# EAGLE design siggen1 (EAGLE 4.15)
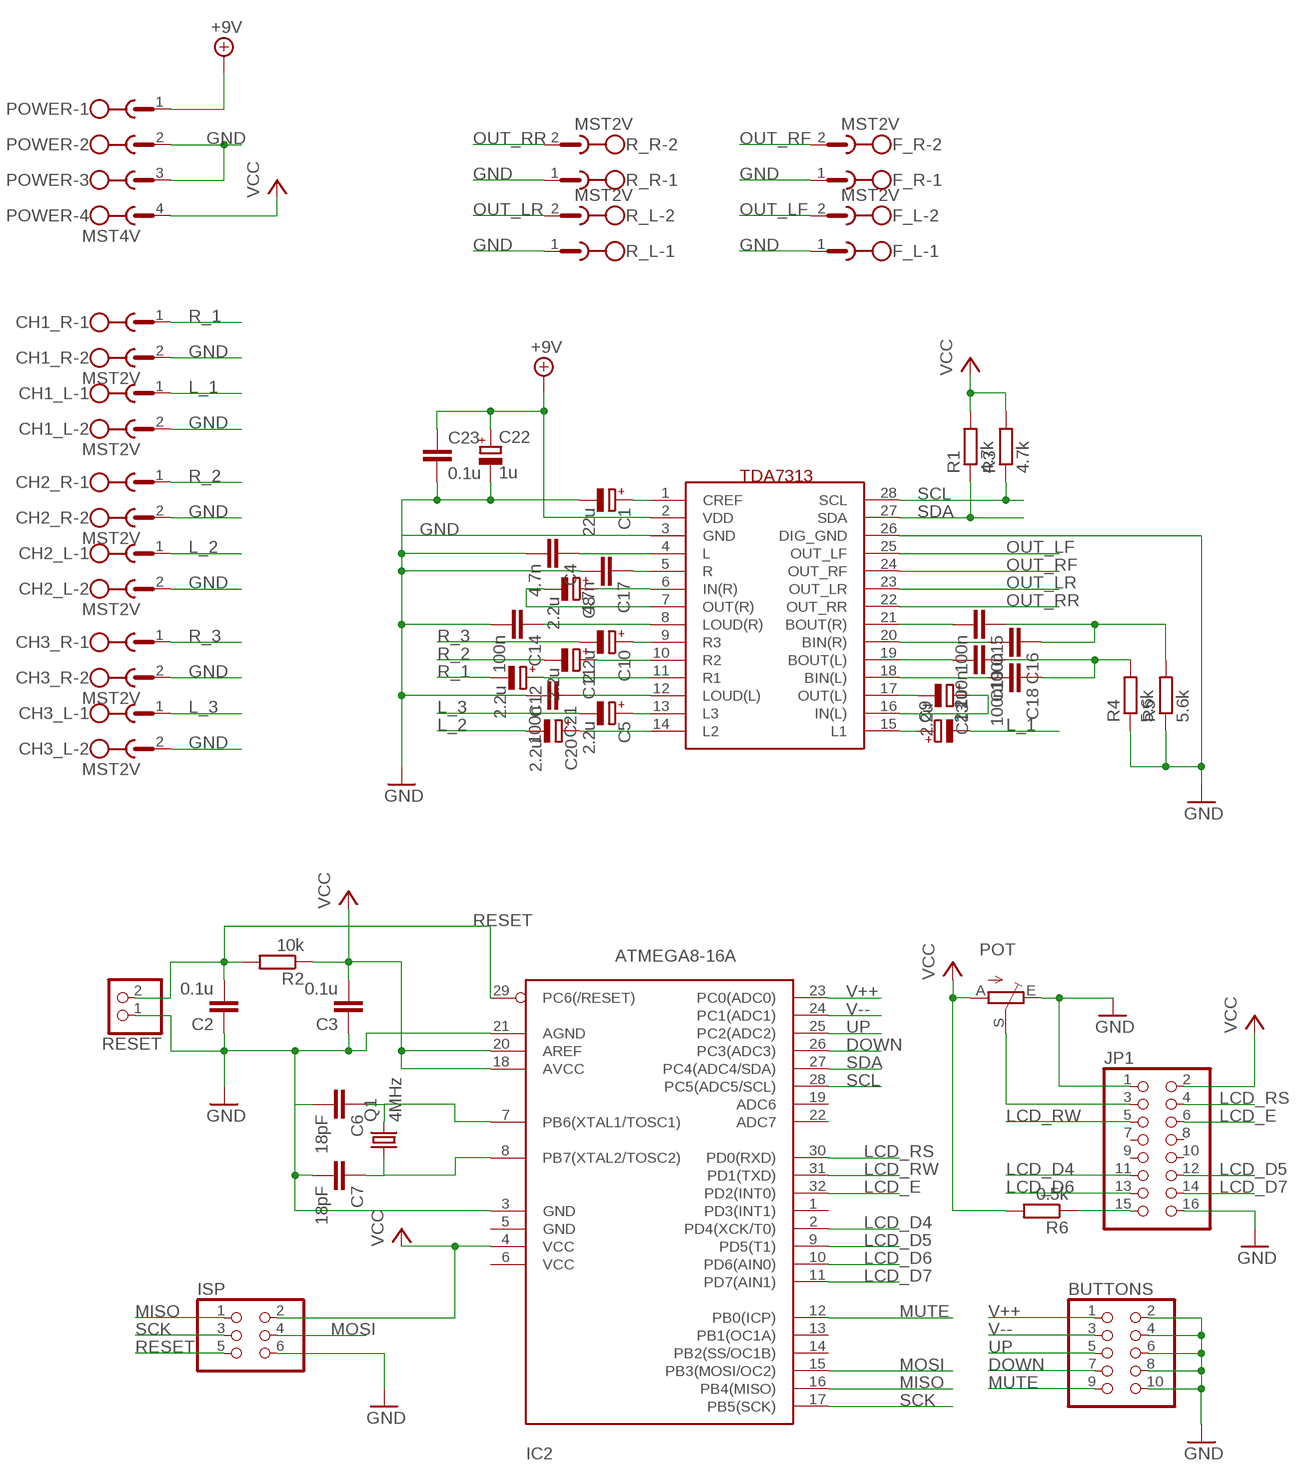
[diagram p0: schematic, sheet 1]

## Parts
BUTTONS  PINHD-2X5  [2X05]
C1  22u  CPOL-EU153CLV-0405  [153CLV-0405]
C2  0.1u  C-EUC0805  [C0805]
C3  0.1u  C-EUC0805  [C0805]
C4  4.7n  C-EUC0805  [C0805]
C5  2.2u  CPOL-EU153CLV-0405  [153CLV-0405]
C6  18pF  C-EUC0805  [C0805]
C7  18pF  C-EUC0805  [C0805]
C8  2.2u  CPOL-EU153CLV-0405  [153CLV-0405]
C9  2.2u  CPOL-EU153CLV-0405  [153CLV-0405]
C10  2.2u  CPOL-EU153CLV-0405  [153CLV-0405]
C11  2.2u  CPOL-EU153CLV-0405  [153CLV-0405]
C12  2.2u  CPOL-EU153CLV-0405  [153CLV-0405]
C13  2.2u  CPOL-EU153CLV-0405  [153CLV-0405]
C14  100n  C-EUC0805  [C0805]
C15  100n  C-EUC0805  [C0805]
C16  100n  C-EUC0805  [C0805]
C17  4.7n  C-EUC0805  [C0805]
C18  100n  C-EUC0805  [C0805]
C19  100n  C-EUC0805  [C0805]
C20  2.2u  CPOL-EU153CLV-0405  [153CLV-0405]
C21  100n  C-EUC0805  [C0805]
C22  1u  CPOL-EU153CLV-0605  [153CLV-0605]
C23  0.1u  C-EUC0805  [C0805]
CH1_L  MST2V  [MSTBV2]
CH1_R  MST2V  [MSTBV2]
CH2_L  MST2V  [MSTBV2]
CH2_R  MST2V  [MSTBV2]
CH3_L  MST2V  [MSTBV2]
CH3_R  MST2V  [MSTBV2]
F_L  MST2V  [MSTBV2]
F_R  MST2V  [MSTBV2]
IC2  ATMEGA8-16A  [TQFP32-08]
ISP  PINHD-2X3  [2X03]
JP1  PINHD-2X8  [2X08]
POT  TRIM_EU-B64Y  [B64Y]
POWER  MST4V  [MSTBV4]
Q1  4MHz  CRYTALHC49S  [HC49/S]
R1  4.7k  R-EU_M0805  [M0805]
R2  10k  R-EU_M0805  [M0805]
R3  4.7k  R-EU_M0805  [M0805]
R4  5.6k  R-EU_R0805  [R0805]
R5  5.6k  R-EU_R0805  [R0805]
R6  0.5k  R-EU_R0805  [R0805]
R_L  MST2V  [MSTBV2]
R_R  MST2V  [MSTBV2]
RESET  PINHD-1X2  [1X02]
U$1  TDA7313_SO28  [SO28]

## Nets
+9V: C22.+ C23.1 POWER.1 U$1.2(VDD)
DOWN: BUTTONS.7 IC2.26(PC3(ADC3))
GND: BUTTONS.2 BUTTONS.4 BUTTONS.6 BUTTONS.8 BUTTONS.10 C1.- C2.1 C3.1 C4.2 C6.2 C7.2 C14.2 C17.2 C21.2 C22.- C23.2 CH1_L.2 CH1_R.2 CH2_L.2 CH2_R.2 CH3_L.2 CH3_R.2 F_L.1 F_R.1 IC2.3(GND) IC2.21(AGND) ISP.6 JP1.1 JP1.16 POT.E POWER.2 POWER.3 R4.1 R5.1 R_L.1 R_R.1 RESET.1 U$1.3(GND) U$1.26(DIG_GND)
L_1: C9.- CH1_L.1
L_2: C20.- CH2_L.1
L_3: C5.- CH3_L.1
LCD_D4: IC2.2(PD4(XCK/T0)) JP1.11
LCD_D5: IC2.9(PD5(T1)) JP1.12
LCD_D6: IC2.10(PD6(AIN0)) JP1.13
LCD_D7: IC2.11(PD7(AIN1)) JP1.14
LCD_E: IC2.32(PD2(INT0)) JP1.6
LCD_RS: IC2.30(PD0(RXD)) JP1.4
LCD_RW: IC2.31(PD1(TXD)) JP1.5
MISO: IC2.16(PB4(MISO)) ISP.1
MOSI: IC2.15(PB3(MOSI/OC2)) ISP.4
MUTE: BUTTONS.9 IC2.12(PB0(ICP))
N$1: JP1.15 R6.1
N$2: JP1.3 POT.S
N$3: C6.1 IC2.7(PB6(XTAL1/TOSC1)) Q1.2
N$4: C7.1 IC2.8(PB7(XTAL2/TOSC2)) Q1.1
N$7: C20.+ U$1.14(L2)
N$9: C5.+ U$1.13(L3)
N$13: C21.1 U$1.12(LOUD(L))
N$14: C12.+ U$1.11(R1)
N$15: C11.+ U$1.10(R2)
N$16: C10.+ U$1.9(R3)
N$17: C17.1 U$1.5(R)
N$18: C4.1 U$1.4(L)
N$19: C1.+ U$1.1(CREF)
N$20: C8.+ U$1.6(IN(R))
N$21: C8.- U$1.7(OUT(R))
N$22: C14.1 U$1.8(LOUD(R))
N$23: C9.+ U$1.15(L1)
N$24: C13.+ U$1.16(IN(L))
N$25: C13.- U$1.17(OUT(L))
N$26: C18.2 U$1.18(BIN(L))
N$27: C18.1 C19.1 R4.2
N$28: C19.2 U$1.19(BOUT(L))
N$29: C16.2 U$1.20(BIN(R))
N$30: C15.1 C16.1 R5.2
N$31: C15.2 U$1.21(BOUT(R))
OUT_LF: F_L.2 U$1.25(OUT_LF)
OUT_LR: R_L.2 U$1.23(OUT_LR)
OUT_RF: F_R.2 U$1.24(OUT_RF)
OUT_RR: R_R.2 U$1.22(OUT_RR)
R_1: C12.- CH1_R.1
R_2: C11.- CH2_R.1
R_3: C10.- CH3_R.1
RESET: C2.2 IC2.29(PC6(/RESET)) ISP.5 R2.2 RESET.2
SCK: IC2.17(PB5(SCK)) ISP.3
SCL: IC2.28(PC5(ADC5/SCL)) R3.1 U$1.28(SCL)
SDA: IC2.27(PC4(ADC4/SDA)) R1.1 U$1.27(SDA)
UP: BUTTONS.5 IC2.25(PC2(ADC2))
V++: BUTTONS.1 IC2.23(PC0(ADC0))
V--: BUTTONS.3 IC2.24(PC1(ADC1))
VCC: C3.2 IC2.4(VCC) IC2.18(AVCC) IC2.20(AREF) ISP.2 JP1.2 POT.A POWER.4 R1.2 R2.1 R3.2 R6.2
Unconnected: IC2.1(PD3(INT1)) IC2.5(GND) IC2.6(VCC) IC2.13(PB1(OC1A)) IC2.14(PB2(SS/OC1B)) IC2.19(ADC6) IC2.22(ADC7) JP1.7 JP1.8 JP1.9 JP1.10

## Library data of the parts
BUTTONS = pinhead:PINHD-2X5: PIN HEADER
C1 C5 C8-C13 C20 C22 = rcl:CPOL-EU: POLARIZED CAPACITOR, European symbol
C2-C4 C6 C7 C14-C19 C21 C23 = rcl:C-EU: CAPACITOR, European symbol
CH1_L CH1_R CH2_L CH2_R CH3_L CH3_R F_L F_R R_L R_R = con-phoenix-508:MST2V: PHOENIX
IC2 = avr:ATMEGA8: MICROCONTROLLER 8 Kbytes FLASH 1 kbytes SRAM 512 bytes EEPROM USART 6-channel 10 bit ADC 2-channel 8 bit ADC
ISP = pinhead:PINHD-2X3: PIN HEADER
JP1 = pinhead:PINHD-2X8: PIN HEADER
POT = pot:TRIM_EU-: POTENTIOMETER
POWER = con-phoenix-508:MST4V: PHOENIX
Q1 = crystal:CRYTAL: CRYSTAL
R1-R6 = rcl:R-EU_: RESISTOR, European symbol
RESET = pinhead:PINHD-1X2: PIN HEADER
U$1 = TDA7313:TDA7313_SO28

## Board
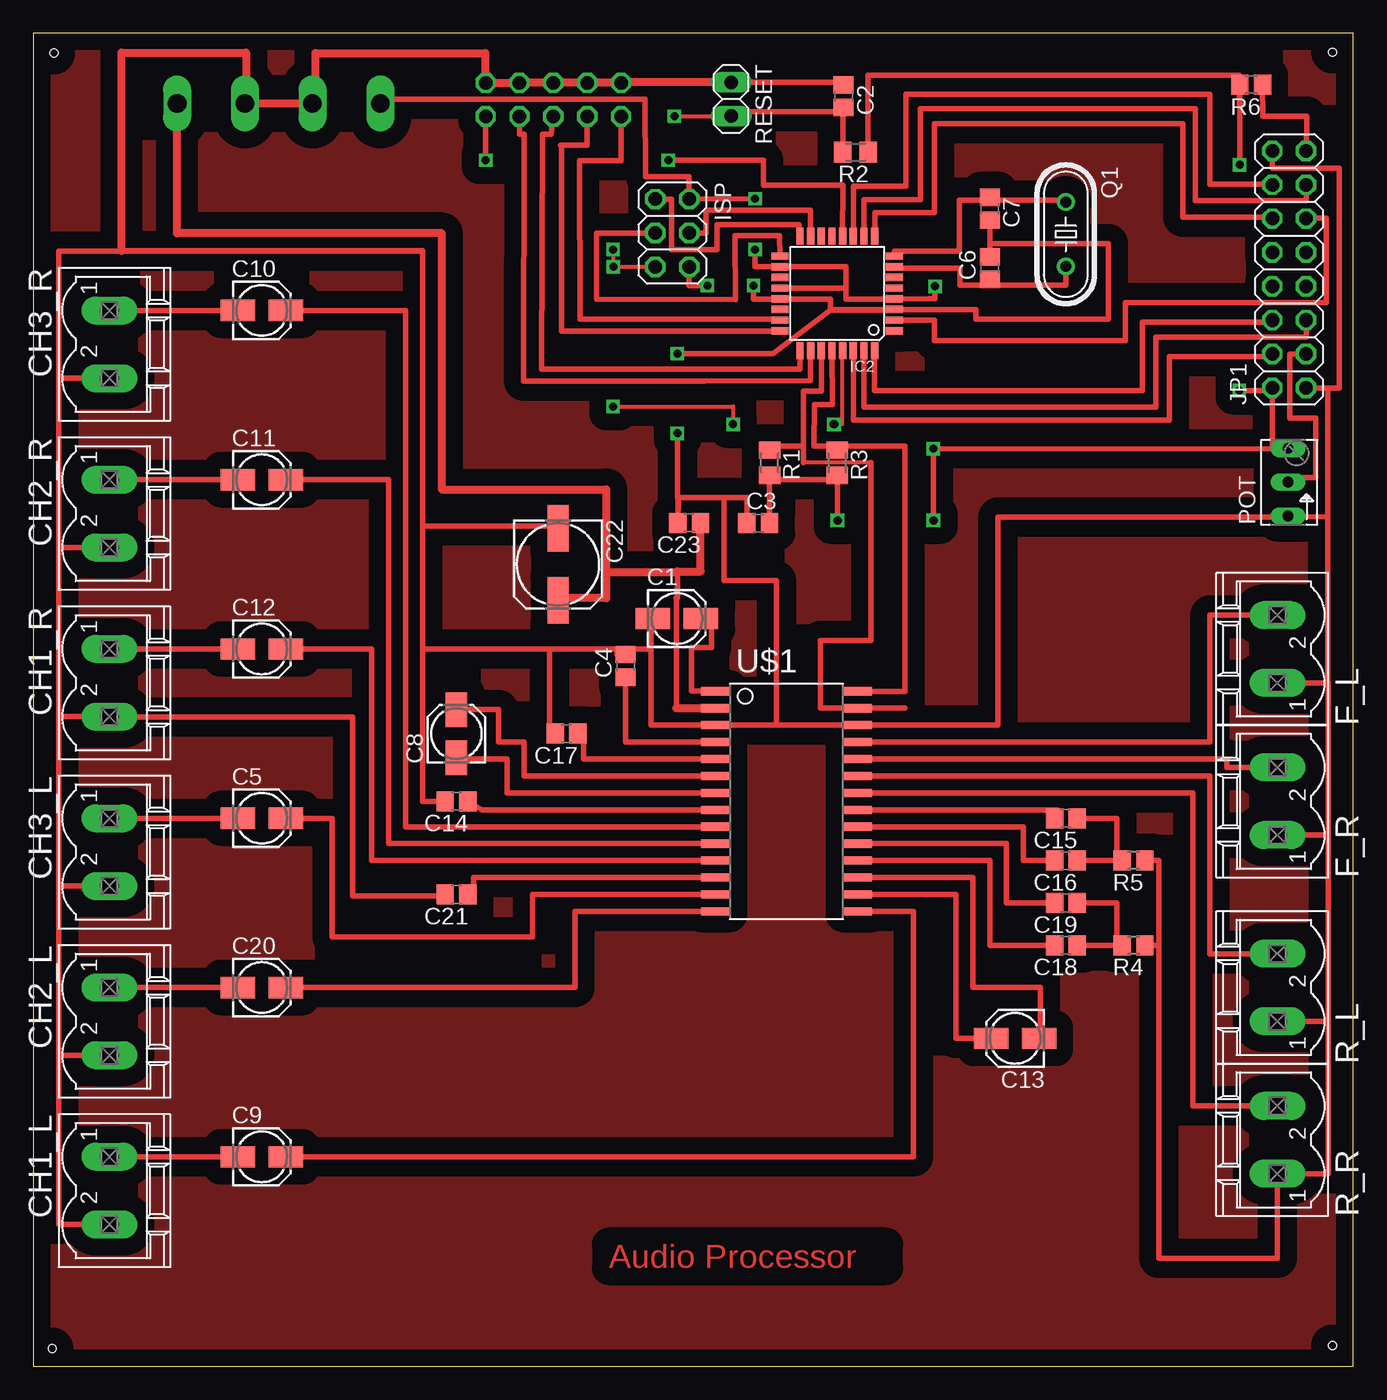
[diagram p1: board, top side]
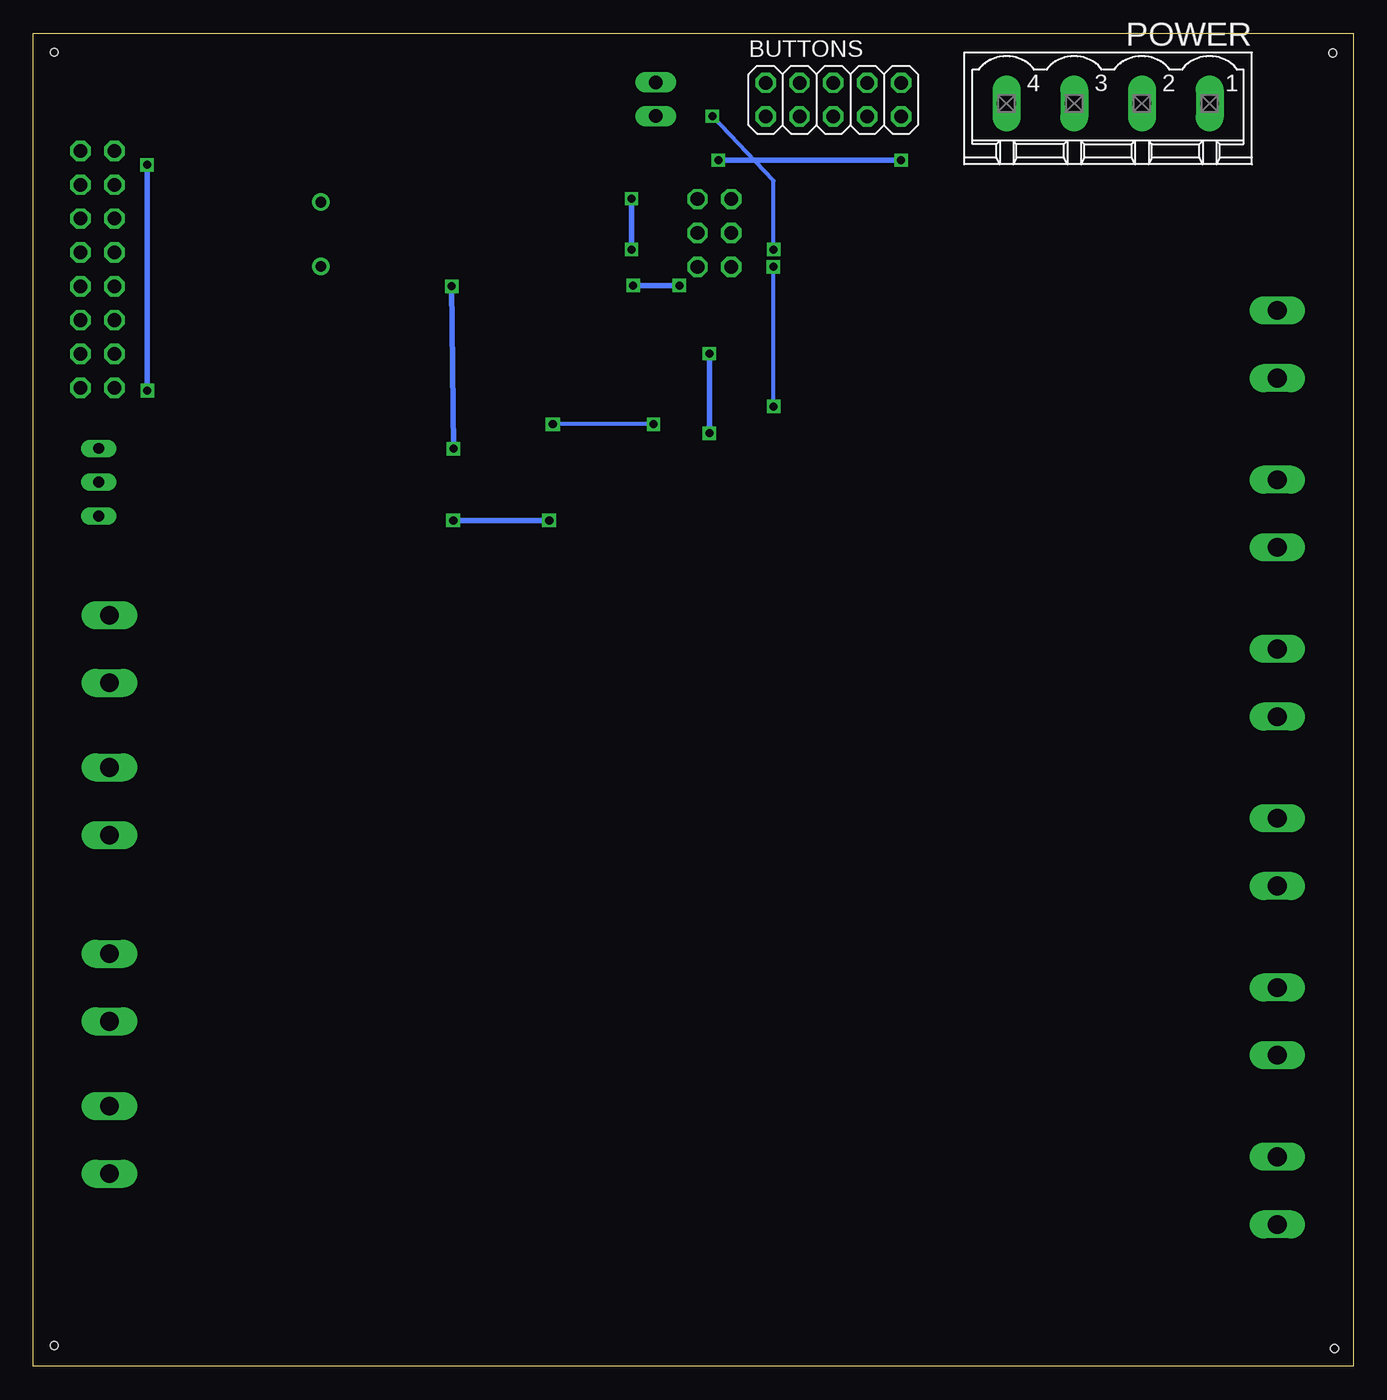
[diagram p2: board, bottom side, seen from below]

Size 99.04 x 100 mm. Coordinates in mm from the lower left corner, seen from the top.
Outline: 0,0 99.04,0 99.04,100 0,100 0,0
Copper layers (1*16): Top 0.035mm / dielectric 1.5mm / Bottom 0.035mm
Design rules "default": minimum track width 10mil, minimum drill 24mil, track to track 8mil, track to pad 8mil, pad to pad 8mil, via to via 8mil, smd to smd 8mil, copper to edge 40mil, drill to drill 8mil, minimum pad ring 10mil, minimum via ring 8mil, stop-mask expansion 4mil, vias tented up to drill 0mil, thermal gap 10mil
Holes 0.6 mm at 97.47,98.58 1.55,98.51 1.42,1.33 97.47,1.55

### Footprints (pad centres in the part's own frame; a part is rotated, then mirrored left to right if it is on the bottom)
2X05 = drill 1.016 octagon: 1 -5.08,-1.27; 2 -5.08,1.27; 3 -2.54,-1.27; 4 -2.54,1.27; 5 0,-1.27; 6 0,1.27; 7 2.54,-1.27; 8 2.54,1.27; 9 5.08,-1.27; 10 5.08,1.27
153CLV-0405 = smd 2.6 x 1.6: + 1.8,0; - -1.8,0
C0805 = smd 1.3 x 1.5: 1 -0.85,0; 2 0.85,0
153CLV-0605 = smd 3.5 x 1.6: + 2.7,0; - -2.7,0
MSTBV2 = drill 1.397 long: 1 -2.54,0; 2 2.54,0
TQFP32-08 = smd 1.27 x 0.559: 1 -4.293,2.8; 2 -4.293,2; 3 -4.293,1.2; 4 -4.293,0.4; 5 -4.293,-0.4; 6 -4.293,-1.2; 7 -4.293,-2; 8 -4.293,-2.8; 17 4.293,-2.8; 18 4.293,-2; 19 4.293,-1.2; 20 4.293,-0.4; 21 4.293,0.4; 22 4.293,1.2; 23 4.293,2; 24 4.293,2.8 | smd 0.559 x 1.27: 9 -2.8,-4.293; 10 -2,-4.293; 11 -1.2,-4.293; 12 -0.4,-4.293; 13 0.4,-4.293; 14 1.2,-4.293; 15 2,-4.293; 16 2.8,-4.293; 25 2.8,4.293; 26 2,4.293; 27 1.2,4.293; 28 0.4,4.293; 29 -0.4,4.293; 30 -1.2,4.293; 31 -2,4.293; 32 -2.8,4.293
2X03 = drill 1.016 octagon: 1 -2.54,-1.27; 2 -2.54,1.27; 3 0,-1.27; 4 0,1.27; 5 2.54,-1.27; 6 2.54,1.27
2X08 = drill 1.016 octagon: 1 -8.89,-1.27; 2 -8.89,1.27; 3 -6.35,-1.27; 4 -6.35,1.27; 5 -3.81,-1.27; 6 -3.81,1.27; 7 -1.27,-1.27; 8 -1.27,1.27; 9 1.27,-1.27; 10 1.27,1.27; 11 3.81,-1.27; 12 3.81,1.27; 13 6.35,-1.27; 14 6.35,1.27; 15 8.89,-1.27; 16 8.89,1.27
B64Y = drill 0.813 long: A 2.54,0; E -2.54,0; S 0,0
MSTBV4 = drill 1.397 long: 1 -7.62,0; 2 -2.54,0; 3 2.54,0; 4 7.62,0
HC49/S = drill 0.813 round: 1 -2.413,0; 2 2.413,0
M0805 = smd 1.3 x 1.6: 1 -0.95,0; 2 0.95,0
R0805 = smd 1.3 x 1.5: 1 -0.85,0; 2 0.85,0
1X02 = drill 1.016 long: 1 -1.27,0; 2 1.27,0
SO28 = smd 0.61 x 2.21: 1 -8.255,-5.315; 2 -6.985,-5.315; 3 -5.715,-5.315; 4 -4.445,-5.315; 5 -3.175,-5.315; 6 -1.905,-5.315; 7 -0.635,-5.315; 8 0.635,-5.315; 9 1.905,-5.315; 10 3.175,-5.315; 11 4.445,-5.315; 12 5.715,-5.315; 13 6.985,-5.315; 14 8.255,-5.315; 15 8.255,5.315; 16 6.985,5.315; 17 5.715,5.315; 18 4.445,5.315; 19 3.175,5.315; 20 1.905,5.315; 21 0.635,5.315; 22 -0.635,5.315; 23 -1.905,5.315; 24 -3.175,5.315; 25 -4.445,5.315; 26 -5.715,5.315; 27 -6.985,5.315; 28 -8.255,5.315

### Placement (x,y rotation side)
BUTTONS  39.02,95.02 0 bottom
C1  48.29,56.1 0 top
C2  60.8,95.28 270 top
C3  54.38,63.24 0 top
C4  44.45,52.54 90 top
C5  17.14,41.11 0 top
C6  71.75,82.39 90 top
C7  71.75,86.83 270 top
C8  31.74,47.46 90 top
C9  17.14,15.71 0 top
C10  17.14,79.21 0 top
C11  17.14,66.51 0 top
C12  17.14,53.81 0 top
C13  73.66,24.6 180 top
C14  31.74,42.38 180 top
C15  77.46,41.11 180 top
C16  77.46,37.94 180 top
C17  40,47.46 180 top
C18  77.46,31.58 180 top
C19  77.46,34.76 180 top
C20  17.14,28.41 0 top
C21  31.74,35.39 180 top
C22  39.37,60.16 270 top
C23  49.21,63.27 180 top
CH1_L  5.71,13.17 270 top
CH1_R  5.71,51.27 270 top
CH2_L  5.71,25.87 270 top
CH2_R  5.71,63.97 270 top
CH3_L  5.71,38.57 270 top
CH3_R  5.71,76.67 270 top
F_L  93.34,53.81 90 top
F_R  93.34,42.38 90 top
IC2  60.32,80.48 180 top
ISP  47.94,85.02 270 top
JP1  94.23,82.29 90 top
POT  94.13,66.32 90 top
POWER  18.41,94.74 180 bottom
Q1  77.46,84.92 270 top
R1  55.24,67.78 270 top
R2  61.69,91.08 180 top
R3  60.32,67.78 270 top
R4  82.55,31.58 180 top
R5  82.55,37.94 180 top
R6  91.37,96.13 180 top
R_L  93.34,28.41 90 top
R_R  93.34,16.98 90 top
RESET  52.35,95.05 270 top
U$1  56.51,42.38 270 top

### Tracks (layer width: path | path; a pad name or v marks a point on that pad's centre or on a via)
+9V
  Top 0.406: 48.26,57.62 48.26,49.37 | 48.26,57.62 48.22,57.62 | 39.37,57.62 C22.+ | 48.32,59.62 48.32,59.59 48.32,57.62 48.26,57.62 | 42.98,59.75 42.98,59.59
  Top 0.61: 48.26,49.37 U$1.2 | C23.1 50.06,59.62 48.32,59.62 | POWER.1 10.79,84.99 30.66,84.99 30.66,65.78 42.98,65.78 42.98,59.75 42.98,57.62 39.37,57.62 | 42.98,59.59 48.32,59.59
DOWN
  Top 0.406: 58.32,76.03 58.38,76.03 | 58.32,76.03 IC2.26 | 58.32,76.03 58.32,73.94 50.35,73.91 36.79,73.91 36.83,92.42 36.48,92.42 BUTTONS.7 | 58.32,76.03
GND  (via drill 0.6)
  Top 0.406: 97.15,51.27 F_L.1 | 97.15,51.27 97.15,39.84 | 97.15,39.84 F_R.1 | 97.15,39.84 97.15,25.87 | 97.15,25.87 R_L.1 | 97.15,25.87 97.15,14.44 R_R.1 93.34,8.09 84.45,8.09 84.45,37.94 | 1.9,74.13 CH3_R.2 | 1.9,61.43 1.9,74.13 | 1.9,61.43 CH2_R.2 | 1.9,48.73 1.9,61.43 | 1.9,48.73 CH1_R.2 5.71,48.7 | 1.9,36.03 1.9,48.73 | 1.9,36.03 CH3_L.2 | 1.9,23.33 1.9,36.03 | 1.9,23.33 CH2_L.2 | 1.9,23.33 1.9,10.63 CH1_L.2 | 84.45,37.94 R5.1 | 84.45,37.94 84.45,31.58 R4.1 | 46.35,53.81 46.35,48.09 U$1.3 55.75,48.09 | 46.35,53.81 44.45,53.81 C4.2 43.81,53.39 43.81,53.81 38.73,53.81 | 39.37,47.46 C17.2 38.73,47.46 38.73,53.81 | 39.37,63.02 39.37,63.34 | 29.2,53.81 38.73,53.81 | C14.2 29.2,42.38 29.2,53.81 | 55.75,48.09 U$1.26 72.38,48.09 72.38,63.72 94.29,63.72 | 29.2,83.66 29.2,63.34 | 29.2,63.34 29.2,53.81 | 29.2,83.66 1.9,83.66 1.9,74.13 | C7.2 C6.2 71.75,84.23 80.64,84.23 80.64,78.58 70.7,78.58 70.7,79.27 70.61,79.27 | 56.03,80.07 IC2.21 | 56.03,80.07 59.81,80.07 59.81,79.3 59.84,79.3 59.84,79.27 | 59.84,79.27 59.84,79.24 64.61,79.24 IC2.3 | IC2.3 | 70.61,79.27 IC2.3 | 97.12,73.4 JP1.1 | 97.12,63.75 97.12,73.4 | 94.29,63.72 97.12,63.75 | 94.29,63.72 94.13,63.72 POT.E | 97.15,51.27 97.15,51.24 97.12,51.24 97.12,63.75 | 21.14,94.77 20.95,94.77 POWER.3 | 15.87,94.77 POWER.2 15.87,94.83 | 15.87,94.83 21.17,94.83 | 33.9,96.39 33.94,96.39 BUTTONS.10 | 36.54,96.29 BUTTONS.8 36.48,96.32 | 39.21,96.32 39.02,96.32 BUTTONS.6 | 41.62,96.32 41.56,96.32 BUTTONS.4 | BUTTONS.2 44.1,96.32 44.29,96.32 44.29,96.36 | 29.2,83.66 29.2,83.69 6.63,83.69 | 15.97,94.83 15.87,94.83 | C1.- 46.49,56.03 46.35,56.03 46.35,53.81 | C3.1 53.53,65.18 51.81,65.18 | 48.41,65.18 48.35,65.18 48.35,63.34
  Top 0.406: 48.35,63.34 48.36,63.34 C23.2 48.41,65.24 48.41,65.18 | 48.35,63.34 48.32,63.34 | 39.37,63.02 C22.- | 29.2,63.34 29.2,63.02 39.37,63.02 | C21.2 30.89,35.3 23.97,35.3 23.97,48.7 5.71,48.7 | 5.71,48.7 5.65,48.7 | 52.35,96.36 RESET.1 | C2.1 60.8,96.32 RESET.1 | RESET.1 | 56.03,80.07 54.03,80.07 v54.03,81.08 | ISP.6 49.21,81.08 v50.57,81.08 50.54,81.05 | JP1.16 92.96,89.88 97.98,89.88 97.98,73.4 97.12,73.4 | 59.84,79.27 70.61,79.27 | 59.84,79.27 55.49,75.97 v48.32,75.97 | 48.41,65.18 48.32,65.18 v48.32,70 | 51.81,65.18 48.41,65.18 | 51.81,65.18 51.81,58.95 55.75,58.95 55.75,48.09
  Top 0.61: 15.87,94.77 20.95,94.77 | 21.17,94.83 21.17,98.51 33.9,98.51 33.9,96.39 | BUTTONS.10 BUTTONS.8 | 36.48,96.32 39.02,96.32 41.56,96.32 44.1,96.32 | 6.63,83.69 6.63,98.55 15.97,98.55 15.97,94.83 | 44.29,96.36 52.35,96.36
  Bottom 0.406: 54.07,81.08 v54.03,81.08 v50.57,81.08 | v48.32,70 v48.32,75.97
L_1
  Top 0.406: CH1_L.1 C9.-
L_2
  Top 0.406: CH2_L.1 C20.-
L_3
  Top 0.406: CH3_L.1 C5.-
LCD_D4
  Top 0.406: JP1.11 95.5,86.13 96.99,86.13 96.99,79.78 81.94,79.78 81.94,76.96 67.62,76.96 67.62,78.48 IC2.2 | IC2.2
LCD_D5
  Top 0.406: JP1.12 92.96,86.19 86.23,86.19 86.23,93.21 67.62,93.21 67.62,86.54 63.15,86.54 63.15,85.05 63.12,85.05 IC2.9
LCD_D6
  Top 0.406: JP1.13 95.5,87.43 87.18,87.43 87.18,94.36 66.57,94.36 66.57,87.53 62.32,87.53 62.32,85.08 | 62.32,85.08 | IC2.10 62.32,85.08
LCD_D7
  Top 0.406: JP1.14 92.96,88.67 88.26,88.67 88.26,95.43 65.46,95.43 65.46,88.55 61.53,88.55 61.53,85.08 61.52,85.08 | 61.52,85.08 61.5,85.08 | IC2.11 61.52,85.08
LCD_E
  Top 0.406: JP1.6 92.96,78.32 83.21,78.32 83.21,73.21 63.11,73.21 63.11,76.07 | 63.11,76.07 63.12,76.07 IC2.32 | 63.11,76.07 63.05,76.07
LCD_RS
  Top 0.406: JP1.4 92.96,75.75 85.24,75.75 85.24,70.99 61.53,70.99 61.53,76 61.52,76 | 61.52,76 61.46,76 | 61.52,76 IC2.30
LCD_RW
  Top 0.406: JP1.5 95.5,77.21 84.23,77.21 84.23,71.97 62.32,71.97 62.32,76.1 | 62.32,76.1 62.29,76.1 | 62.32,76.1 IC2.31 | 62.32,76.1
MISO
  Top 0.406: IC2.16 57.52,84.89 57.43,84.89 57.43,85.66 51.3,85.66 51.3,83.78 47.87,83.78 47.87,87.56 ISP.1
MOSI
  Top 0.406: IC2.15 58.32,86.26 58.29,86.26 58.29,86.73 50.48,86.73 50.48,85.02 ISP.4
MUTE  (via drill 0.6)
  Top 0.406: v33.94,90.48 BUTTONS.9 | IC2.12 60.73,88.61 54.76,88.61 54.76,90.48 v47.65,90.48
  Bottom 0.406: v33.94,90.48 v47.65,90.48
N$1
  Top 0.406: JP1.15 95.53,93.78 92.26,93.78 R6.1
N$2
  Top 0.406: POT.S 94.13,66.67 96.23,66.67 96.23,71.11 94.26,71.11 94.26,75.94 JP1.3 95.53,75.94
N$3
  Top 0.406: IC2.7 64.61,82.39 69.53,82.39 69.53,81.11 71.75,81.11 | 71.75,81.11 C6.1 | Q1.2 77.46,81.11 71.75,81.11
N$4
  Top 0.406: IC2.8 64.61,83.66 69.5,83.66 69.5,87.47 71.75,87.47 | Q1.1 77.46,87.47 71.75,87.47 | 71.75,87.47 C7.1
N$5  (via drill 0.6)
  other vias: 90.48,73.18
N$6  (via drill 0.6)
  other vias: 60.35,63.46
N$7
  Top 0.406: C20.+ 40.64,28.41 40.64,34.12 U$1.14
N$8  (via drill 0.6)
  other vias: 67.56,63.46
N$9
  Top 0.406: C5.+ 22.41,41.11 22.41,32.22 37.46,32.22 37.46,35.39 U$1.13
N$10
  pour Top (isolate 1.27, no thermals): 0.63,99.59 97.02,99.59 arc-90 98.29,98.32 98.29,0.88 2.12,0.88 arc-90 0.85,2.15 0.85,99.4
N$12  (via drill 0.6)
  other vias: 60.03,70.67
N$13
  Top 0.406: U$1.12 33.02,36.66 33.02,35.39 C21.1
N$14
  Top 0.406: C12.+ 25.39,53.81 25.39,37.94 U$1.11
N$15
  Top 0.406: C11.+ 26.66,66.51 26.66,39.2 U$1.10
N$16
  Top 0.406: C10.+ 27.93,79.21 27.93,40.48 U$1.9
N$17
  Top 0.406: U$1.5 41.27,45.55 41.27,47.46 C17.1
N$18
  Top 0.406: U$1.4 44.45,46.82 44.45,51.27 C4.1
N$19
  Top 0.406: U$1.1 51.2,50.67 49.37,50.67 49.37,53.91 50.89,53.91 50.89,56.06 50.09,56.06 C1.+
N$20
  Top 0.406: C8.+ 34.92,49.26 34.92,46.82 36.83,46.82 36.83,44.28 U$1.6
N$21
  Top 0.406: U$1.7 35.55,43.02 35.55,45.55 31.74,45.55 C8.-
N$22
  Top 0.406: U$1.8 33.65,41.74 C14.1
N$23
  Top 0.406: C9.+ 66.03,15.71 66.03,34.12 U$1.15
N$24
  Top 0.406: U$1.16 69.21,35.39 69.21,24.6 C13.+
N$25
  Top 0.406: U$1.17 70.48,36.66 70.48,28.41 75.56,28.41 75.56,24.6 C13.-
N$26
  Top 0.406: U$1.18 71.75,37.94 71.75,31.58 C18.2
N$27
  Top 0.406: C18.1 81.27,31.58 | 81.27,31.58 R4.2 | C19.1 81.27,34.76 81.27,31.58
N$28
  Top 0.406: U$1.19 73.02,39.2 73.02,34.76 C19.2
N$29
  Top 0.406: U$1.20 74.29,40.48 74.29,37.94 C16.2 76.83,37.94
N$30
  Top 0.406: 81.91,37.94 R5.2 81.27,37.94 | C16.1 81.27,37.94 | C15.1 81.27,41.11 81.27,37.94
N$31
  Top 0.406: C15.2 76.83,41.11 76.83,41.74 U$1.21
OUT_LF
  Top 0.406: U$1.25 88.26,46.82 88.26,56.35 F_L.2
OUT_LR
  Top 0.406: U$1.23 88.26,44.28 88.26,30.95 R_L.2
OUT_RF
  Top 0.406: U$1.24 89.53,45.55 89.53,44.92 F_R.2
OUT_RR
  Top 0.406: U$1.22 86.99,43.02 86.99,19.52 R_R.2
R_1
  Top 0.406: CH1_R.1 C12.-
R_2
  Top 0.406: CH2_R.1 C11.-
R_3
  Top 0.406: CH3_R.1 C10.-
RESET  (via drill 0.6)
  Top 0.305: v43.52,82.48 ISP.5 | v43.52,82.48 43.49,82.48 | IC2.29 60.7,70.67 v60.1,70.67 | v52.51,70.67 52.51,72 v43.49,72 | v48.1,93.78 RESET.2 | v43.52,82.48 43.56,82.45 v43.49,83.78
  Top 0.406: 60.8,94.1 60.83,94.1 | 60.8,94.1 C2.2 60.8,94.32 60.73,94.32 | RESET.2 52.35,94.1 60.8,94.1 | 60.73,94.32 R2.2 | 60.73,94.32 60.7,94.32
  Bottom 0.305: v52.51,70.67 v60.1,70.67 | v43.49,72 v43.52,82.48 | v48.1,93.78 43.49,88.93 v43.49,83.78
SCK
  Top 0.406: IC2.17 56,84.83 52.64,84.83 52.67,80.04 42.25,80.07 42.25,85.02 46.67,84.99 ISP.3
SCL
  Top 0.406: U$1.28 65.4,50.63 65.4,69.05 60.32,69.05 | 60.32,69.05 R3.1 | IC2.28 59.94,72.16 58.61,72.16 58.59,69.02 60.32,69.05
SDA
  Top 0.305: 62.86,67.78 57.78,67.78
  Top 0.406: 65.4,49.37 U$1.27 59.05,49.37 59.05,54.45 62.86,54.45 62.86,67.78 | R1.1 55.24,69.05 57.78,69.05 | IC2.27 59.12,73.15 57.78,73.15 57.78,69.05 | 57.78,67.78 57.78,69.05
UP
  Top 0.406: IC2.25 57.52,76.03 57.56,76.03 57.53,74.8 49.34,74.8 49.27,74.8 38.13,74.8 38.19,92.42 38.83,92.42 BUTTONS.5
V++
  Top 0.406: 56.03,78.51 IC2.23 56.09,78.54 41.02,78.54 40.98,90.45 44.1,90.45 BUTTONS.1
V--
  Top 0.406: 56.03,77.72 IC2.24 56.03,77.65 39.62,77.65 39.62,91.59 | BUTTONS.3 41.56,91.59 39.62,91.59 | 39.62,91.59 39.55,91.59
VCC  (via drill 0.6)
  Top 0.406: 55.24,66.51 R1.2 | 55.24,66.51 60.32,66.51 R3.2 v60.32,63.46 | IC2.20 56.03,80.89 60.96,80.89 | 60.96,80.07 60.96,80.89 | IC2.4 64.61,80.07 60.96,80.07 | IC2.18 | IC2.18 60.96,82.48 60.96,80.89 | POWER.4 26.06,95.05 45.91,95.05 45.94,89.24 49.21,89.24 ISP.2 v54.16,87.59 | C3.2 55.23,63.34 55.24,63.34 55.24,66.51 | R2.1 62.64,96.86 90.48,96.86 90.48,94.67 90.52,94.67 | 90.52,94.67 90.58,94.67 | 90.52,94.67 R6.2 90.52,90.13 v90.51,90.13 | 92.96,73.34 92.96,73.21 v90.48,73.21 | 60.96,80.07 67.18,80.1 67.65,80.1 v67.65,81.02 | 92.96,73.34 JP1.2 | 92.96,73.34 92.96,68.89 POT.A 67.49,68.8 v67.53,68.83 v67.53,63.46 | IC2.18 54.16,82.48 v54.16,83.78
  Bottom 0.406: v90.51,90.13 90.51,73.21 v90.48,73.21 | v67.53,68.83 v67.65,81.02 | v60.32,63.46 v67.53,63.46 | v54.16,83.78 v54.16,87.59

### Text on the board
Top: Audio Processor